# EAGLE design untitled (EAGLE 9.6.2)
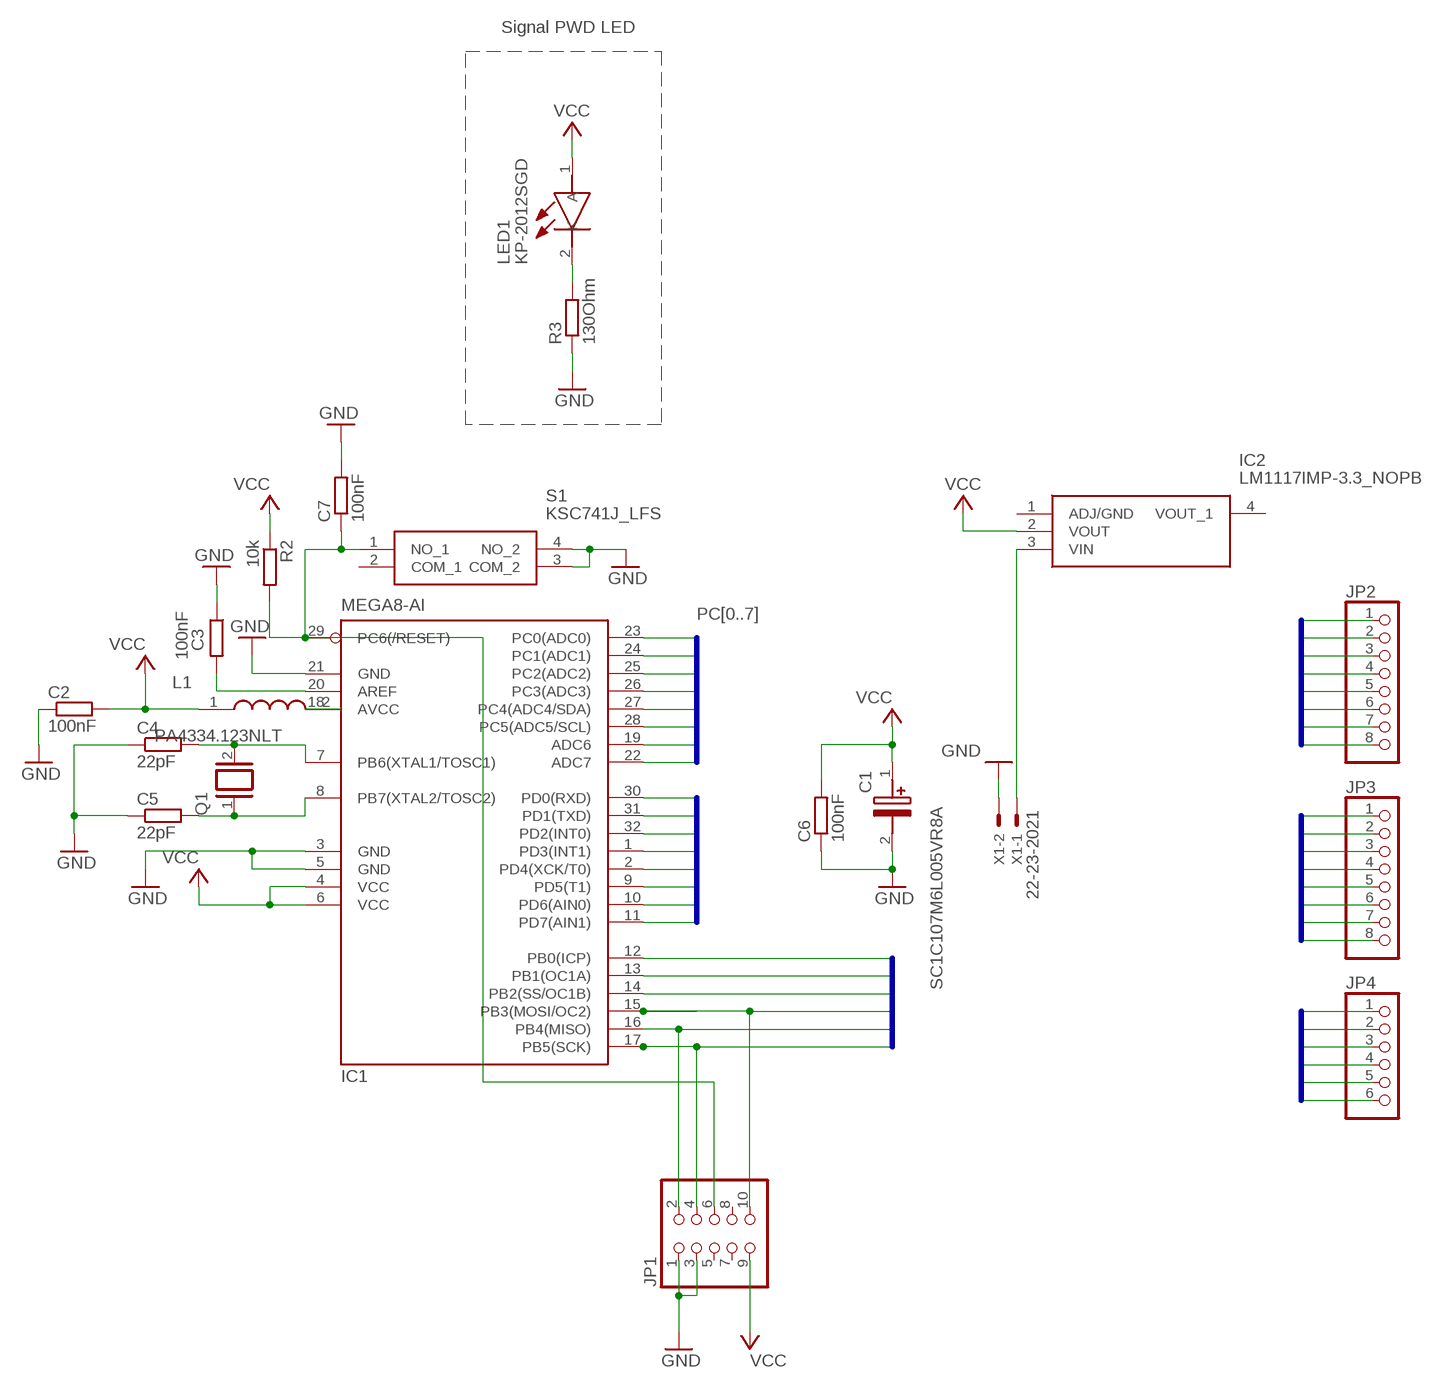
[diagram p0: schematic, sheet 1]

## Parts
C1  SC1C107M6L005VR8A  [CAPAE660X560N]
C2  100nF  R-EU_R0805  [R0805]
C3  100nF  R-EU_R0805  [R0805]
C4  22pF  R-EU_R0805  [R0805]
C5  22pF  R-EU_R0805  [R0805]
C6  100nF  R-EU_R0805  [R0805]
C7  100nF  R-EU_R0805  [R0805]
IC1  MEGA8-AI  [TQFP32-08]
IC2  LM1117IMP-3.3_NOPB  [SOT230P700X180-4N]
JP1  PINHD-2X5  [2X05]
JP2  PINHD-1X8  [1X08]
JP3  PINHD-1X8  [1X08]
JP4  PINHD-1X6  [1X06]
L1  PA4334.123NLT  [PA4334123NLT]
LED1  KP-2012SGD  [KP2012SGD]
Q1  XTAL/S  [QS]
R2  10k  R-EU_R0805  [R0805]
R3  130Ohm  R-EU_R0805  [R0805]
S1  KSC741J_LFS  [KSC821JOLLFS]
X1  22-23-2021  [22-23-2021]

## Nets
GND: C1.2(-) C2.1 C3.1 C4.1 C5.1 C6.1 C7.2 IC1.3(GND) IC1.5(GND) IC1.21(GND) JP1.1 JP1.3 R3.1 S1.3(COM_2) S1.4(NO_2) X1.2
N$1: C7.1 IC1.29(PC6(/RESET)) JP1.6 R2.2 S1.1(NO_1)
N$2: IC1.18(AVCC) L1.2
N$3: C3.2 IC1.20(AREF)
N$4: C4.2 IC1.7(PB6(XTAL1/TOSC1)) Q1.2
N$5: C5.2 IC1.8(PB7(XTAL2/TOSC2)) Q1.1
N$6: LED1.2(K) R3.2
N$7: IC2.3(VIN) X1.1
PB0: IC1.12(PB0(ICP)) JP4.1
PB1: IC1.13(PB1(OC1A)) JP4.2
PB2: IC1.14(PB2(SS/OC1B)) JP4.3
PB3: IC1.15(PB3(MOSI/OC2)) JP1.10 JP4.4
PB4: IC1.16(PB4(MISO)) JP1.2 JP4.5
PB5: IC1.17(PB5(SCK)) JP1.4 JP4.6
PC0: IC1.23(PC0(ADC0)) JP2.1
PC1: IC1.24(PC1(ADC1)) JP2.2
PC2: IC1.25(PC2(ADC2)) JP2.3
PC3: IC1.26(PC3(ADC3)) JP2.4
PC4: IC1.27(PC4(ADC4/SDA)) JP2.5
PC5: IC1.28(PC5(ADC5/SCL)) JP2.6
PC6: IC1.19(ADC6) JP2.7
PC7: IC1.22(ADC7) JP2.8
PD0: IC1.30(PD0(RXD)) JP3.1
PD1: IC1.31(PD1(TXD)) JP3.2
PD2: IC1.32(PD2(INT0)) JP3.3
PD3: IC1.1(PD3(INT1)) JP3.4
PD4: IC1.2(PD4(XCK/T0)) JP3.5
PD5: IC1.9(PD5(T1)) JP3.6
PD6: IC1.10(PD6(AIN0)) JP3.7
PD7: IC1.11(PD7(AIN1)) JP3.8
VCC: C1.1(+) C2.2 C6.2 IC1.4(VCC) IC1.6(VCC) IC2.2(VOUT) JP1.9 L1.1 LED1.1(A) R2.1
Unconnected: IC2.4(VOUT_1) JP1.5 JP1.7 JP1.8 S1.2(COM_1)

## Buses
PC[0..7]
PD[0..7]
PB[0..5]

## Notes on the sheet
- Signal PWD LED

## Power pins joined to a net without a drawn wire
ADJ/GND: IC2.1(ADJ/GND)

## Library data of the parts
C1 = SamacSys_Parts:SC1C107M6L005VR8A: SURFACE MOUNT ALUMINUM ELECTROLYTIC CAPACITOR Source: Datasheet <https://store.comet.bg/download-file.php?id=10409>; DESCRIPTION: SURFACE MOUNT ALUMINUM ELECTROLYTIC CAPACITOR; HEIGHT: 5.6mm; MANUFACTURER_NAME: Samwha Capacitor; MANUFACTURER_PART_NUMBER: SC1C107M6L005VR8A
C2-C7 R2 R3 = rcl:R-EU_: RESISTOR, European symbol; SPICEPREFIX: R
IC1 = atmel:MEGA8: MICROCONTROLLER 8 Kbytes FLASH, 1 kbytes SRAM, 512 bytes EEPROM, USART, 6-channel 10 bit ADC, 2-channel 8 bit ADC Pin compatible with Atmega48, ATMega88, ATMega168 Source: avr.lbr; MPN: ATMEGA8-16AU; OC_FARNELL: 9171371; OC_NEWARK: 73M8863
IC2 = SamacSys_Parts:LM1117IMP-3.3_NOPB: LM1117IMP-3.3/NOPB, Low Dropout Voltage Regulator, 1.5A, 3.3 V +/-1%, 4-Pin SOT-223 Source: Datasheet <http://docs-emea.rs-online.com/webdocs/05bb/0900766b805bb323.pdf>; DESCRIPTION: LM1117IMP-3.3/NOPB, Low Dropout Voltage Regulator, 1.5A, 3.3 V +/-1%, 4-Pin SOT-223; HEIGHT: 1.8mm; MANUFACTURER_NAME: Texas Instruments; MANUFACTURER_PART_NUMBER: LM1117IMP-3.3/NOPB; MOUSER_PART_NUMBER: 926-LM1117IMP3.3NOPB; MOUSER_PRICE-STOCK: https://www.mouser.com/Search/Refine.aspx?Keyword=926-LM1117IMP3.3NOPB; RS_PART_NUMBER: 1977198; RS_PRICE-STOCK: http://uk.rs-online.com/web/p/products/1977198
JP1 = pinhead:PINHD-2X5: PIN HEADER
JP2 JP3 = pinhead:PINHD-1X8: PIN HEADER
JP4 = pinhead:PINHD-1X6: PIN HEADER
L1 = SamacSys_Parts:PA4334.123NLT: Fixed Inductors IND, PWR, 3X3X1.2 12 uH, SMT Source: Datasheet <http://productfinder.pulseeng.com/products/datasheets/P763.pdf>; ARROW_PART_NUMBER: PA4334.123NLT; ARROW_PRICE-STOCK: https://www.arrow.com/en/products/pa4334.123nlt/pulse-electronics-corporation; DESCRIPTION: Fixed Inductors IND, PWR, 3X3X1.2 12 uH, SMT; HEIGHT: 1.2mm; MANUFACTURER_NAME: Pulse; MANUFACTURER_PART_NUMBER: PA4334.123NLT; MOUSER_PART_NUMBER: 673-PA4334123NLT; MOUSER_PRICE-STOCK: https://www.mouser.co.uk/ProductDetail/Pulse-Electronics/PA4334123NLT?qs=%2FzQKu7YvIMZI5byjWFMy2Q%3D%3D
LED1 = SamacSys_Parts:KP-2012SGD: LED; SMD; 0805; green; 312mcd; 2x1.25x1.1mm; 120; 2.22.5V; 20mA Source: Datasheet <https://www.arrow.com/en/products/kp-2012sgd/kingbright>; ARROW_PART_NUMBER: KP-2012SGD; ARROW_PRICE-STOCK: https://www.arrow.com/en/products/kp-2012sgd/kingbright; DESCRIPTION: LED; SMD; 0805; green; 312mcd; 2x1.25x1.1mm; 120; 2.22.5V; 20mA; HEIGHT: 1.2mm; MANUFACTURER_NAME: Kingbright; MANUFACTURER_PART_NUMBER: KP-2012SGD; MOUSER_PART_NUMBER: N/A; MOUSER_PRICE-STOCK: https://www.mouser.co.uk/ProductDetail/Kingbright/KP-2012SGD?qs=2JU0tDl2GZ3ofCdUidPmmg%3D%3D
Q1 = special:XTAL/S: CRYSTAL
S1 = SamacSys_Parts:KSC741J_LFS: IP67 Tactile Tactile Switch, SPST-NO 50 mA 1.4mm Surface Mount Source: Datasheet <https://componentsearchengine.com/Datasheets/1/KSC741J LFS.pdf>; ARROW_PART_NUMBER: KSC741J LFS; DESCRIPTION: IP67 Tactile Tactile Switch, SPST-NO 50 mA 1.4mm Surface Mount; HEIGHT: 4mm; MANUFACTURER_NAME: C & K COMPONENTS; MANUFACTURER_PART_NUMBER: KSC741J LFS; MOUSER_PART_NUMBER: 611-KSC741JLFS; MOUSER_PRICE-STOCK: https://www.mouser.com/Search/Refine.aspx?Keyword=611-KSC741JLFS
X1 = con-molex:22-23-2021: .100" (2.54mm) Center Header - 2 Pin; MF: MOLEX; MPN: 22-23-2021; OC_FARNELL: 1462926; OC_NEWARK: 25C3832

## Board
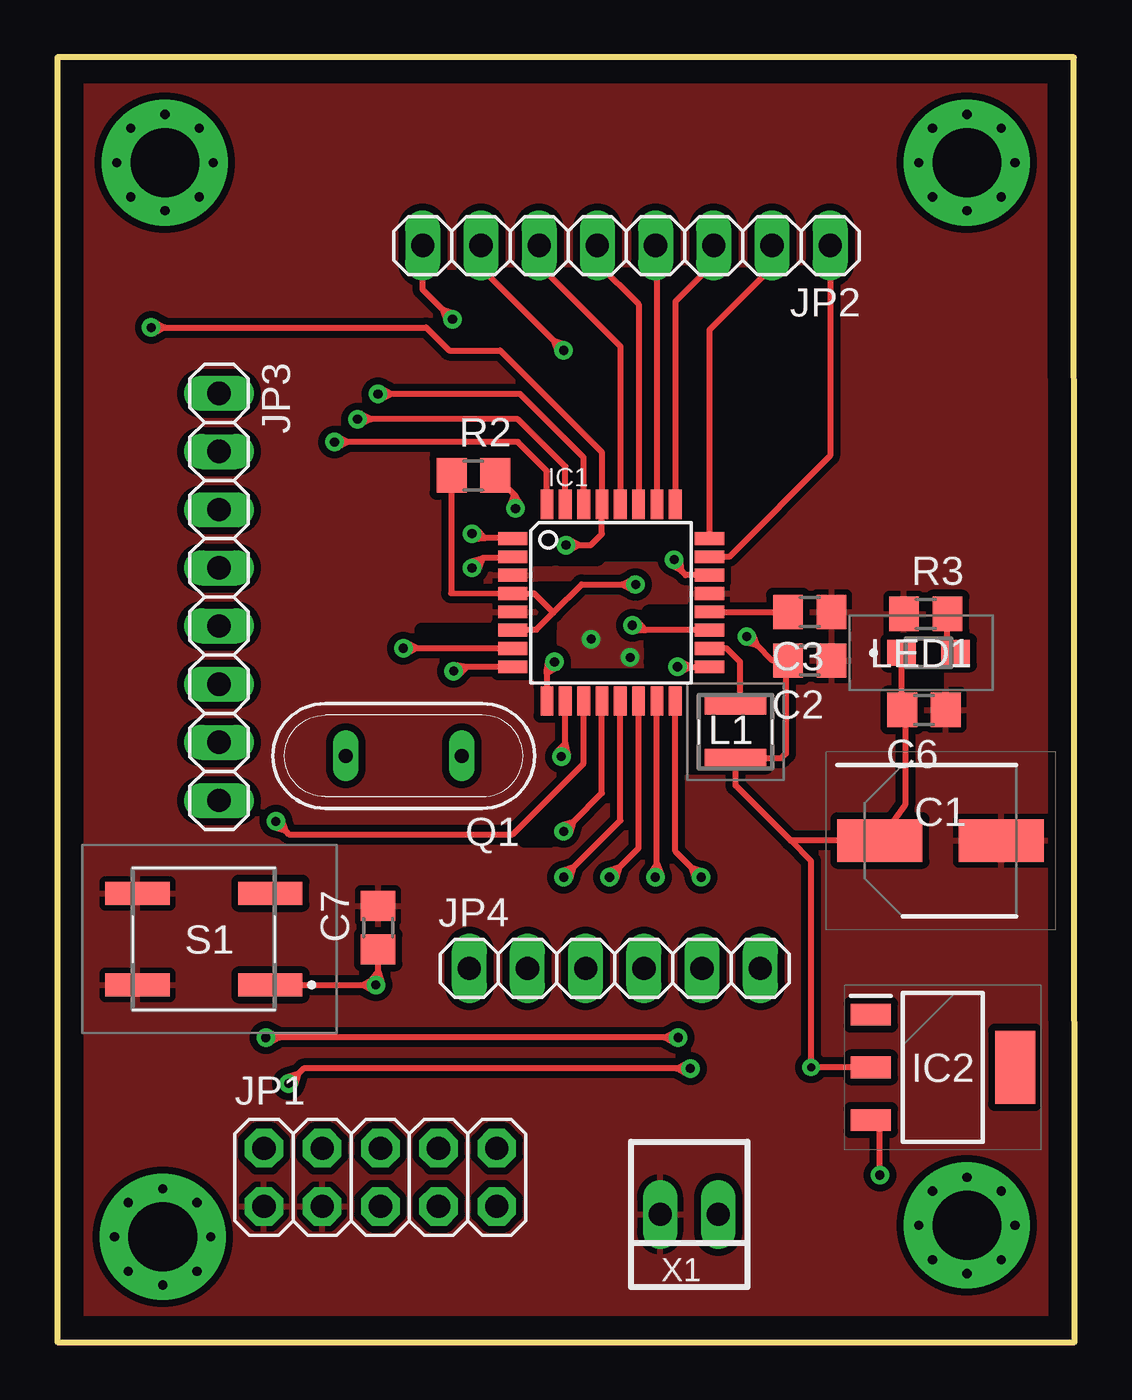
[diagram p1: board, top side]
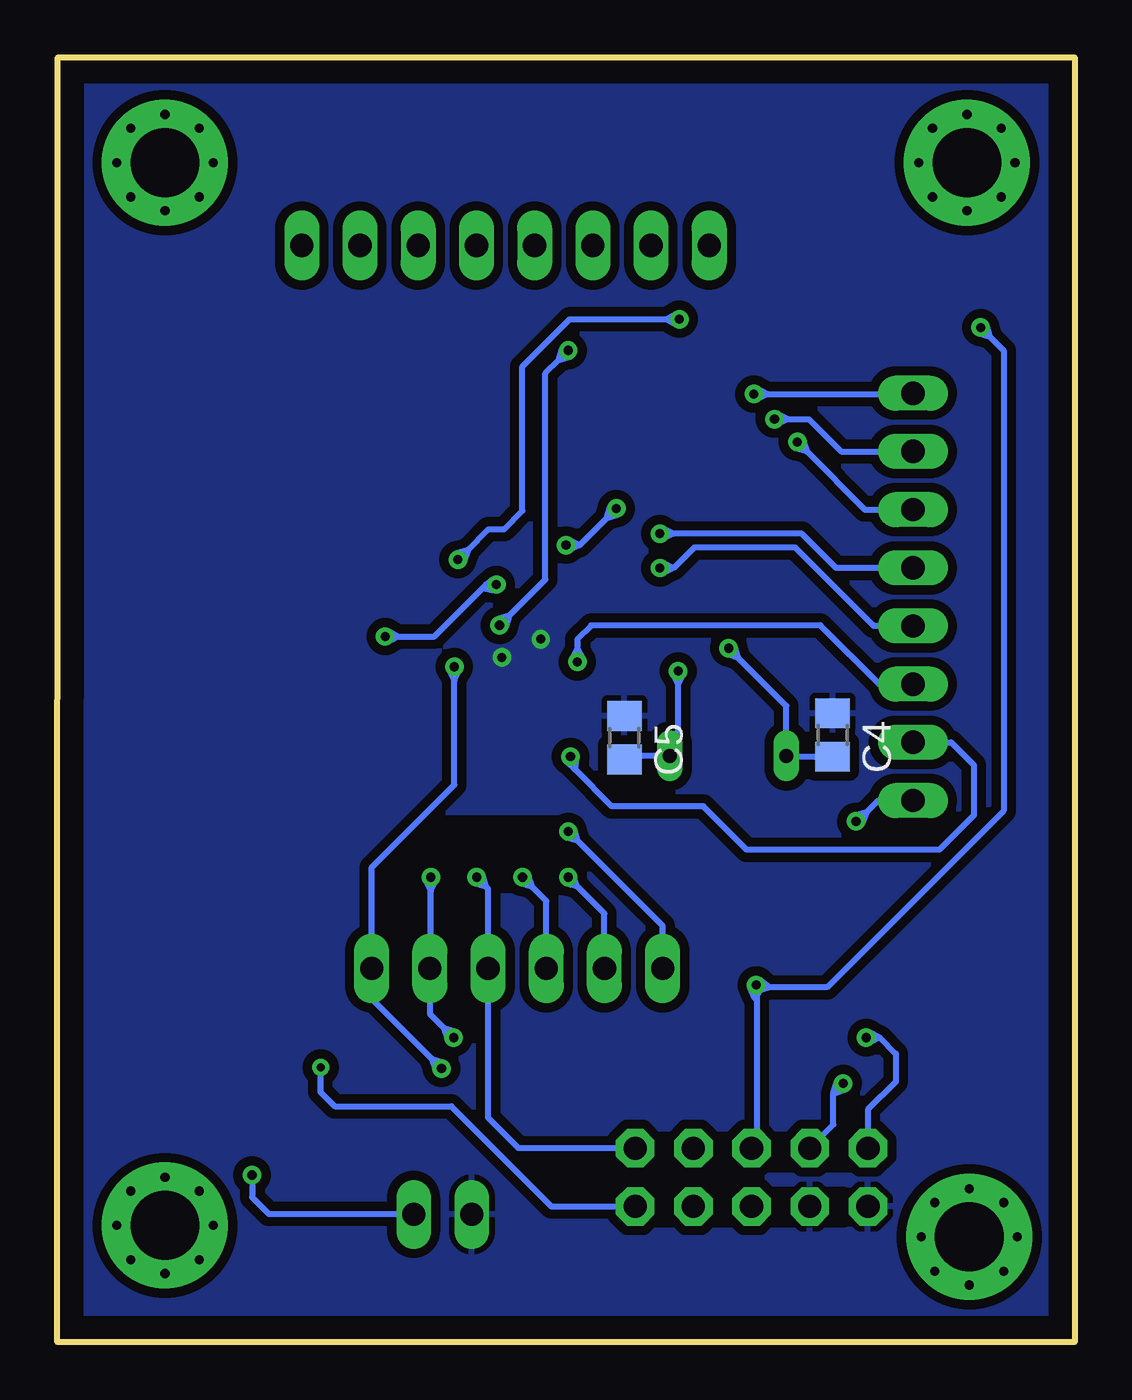
[diagram p2: board, bottom side, seen from below]

Size 44.4 x 56.1 mm. Coordinates in mm from the lower left corner, seen from the top.
Outline: 0,0 44.4,0 44.37,56.1 0,56.1 0,0
Copper layers (1*16): Top 0.035mm / dielectric 1.5mm / Bottom 0.035mm
Design rules "default *": minimum track width 6mil, minimum drill 0.35mm, track to track 9mil, track to pad 9mil, pad to pad 9mil, via to via 9mil, smd to smd 9mil, copper to edge 40mil, drill to drill 10mil, minimum pad ring 10mil, minimum via ring 8mil, stop-mask expansion 4mil, vias tented up to drill 0mil, thermal gap 10mil
tRestrict: area 29.6,46.3 to 30.2,46.6; area 16.9,46.2 to 17.5,46.5; area 19.5,46.3 to 20.1,46.6; area 22,46.3 to 22.6,46.6; area 24.6,46.3 to 25.2,46.6; area 27,46.4 to 27.6,46.7; area 32.2,46.4 to 32.8,46.7; area 28.2,26.1 to 31.5,27.3; area 37.6,28.6 to 38.4,29.4; area 20.7,34.2 to 21.6,34.8; area 24.1,34.6 to 27.6,35.7; area 25.8,31.4 to 27.6,31.9; 9 more areas
bRestrict: area 21.8,20 to 28.1,22.6; area 10.1,5.4 to 18.9,6.4; area 10,7.8 to 18.5,8.8

### Footprints (pad centres in the part's own frame; a part is rotated, then mirrored left to right if it is on the bottom)
CAPAE660X560N = smd 3.7 x 1.85: 1 -2.65,0; 2 2.65,0
R0805 = smd 1.3 x 1.5: 1 -0.95,0; 2 0.95,0
TQFP32-08 = smd 1.27 x 0.559: 1 -4.293,2.8; 2 -4.293,2; 3 -4.293,1.2; 4 -4.293,0.4; 5 -4.293,-0.4; 6 -4.293,-1.2; 7 -4.293,-2; 8 -4.293,-2.8; 17 4.293,-2.8; 18 4.293,-2; 19 4.293,-1.2; 20 4.293,-0.4; 21 4.293,0.4; 22 4.293,1.2; 23 4.293,2; 24 4.293,2.8 | smd 0.559 x 1.27: 9 -2.8,-4.293; 10 -2,-4.293; 11 -1.2,-4.293; 12 -0.4,-4.293; 13 0.4,-4.293; 14 1.2,-4.293; 15 2,-4.293; 16 2.8,-4.293; 25 2.8,4.293; 26 2,4.293; 27 1.2,4.293; 28 0.4,4.293; 29 -0.4,4.293; 30 -1.2,4.293; 31 -2,4.293; 32 -2.8,4.293
SOT230P700X180-4N = smd 1.75 x 0.95: 1 -3.15,2.3; 2 -3.15,0; 3 -3.15,-2.3 | smd 1.75 x 3.2: 4 3.15,0
2X05 = drill 1.016 pad 1.676 octagon: 1 -5.08,-1.27; 2 -5.08,1.27; 3 -2.54,-1.27; 4 -2.54,1.27; 5 0,-1.27; 6 0,1.27; 7 2.54,-1.27; 8 2.54,1.27; 9 5.08,-1.27; 10 5.08,1.27
1X08 = drill 1.016 long: 1 -8.89,0; 2 -6.35,0; 3 -3.81,0; 4 -1.27,0; 5 1.27,0; 6 3.81,0; 7 6.35,0; 8 8.89,0
1X06 = drill 1.016 long: 1 -6.35,0; 2 -3.81,0; 3 -1.27,0; 4 1.27,0; 5 3.81,0; 6 6.35,0
PA4334123NLT = smd 2.7 x 0.8: 1 0,1.15; 2 0,-1.15
KP2012SGD = smd 1.25 x 1.1: 1 -1.175,0; 2 1.175,0
QS = drill 0.61 long: 1 -2.54,0; 2 2.54,0
KSC821JOLLFS = smd 2.8 x 1: 1 -2.9,2; 2 -2.9,-2; 3 2.9,-2; 4 2.9,2
22-23-2021 = drill 1 long: 1 -1.27,0; 2 1.27,0

### Placement (x,y rotation side)
C1  38.55,21.9 0 top
C2  32.84,29.76 180 top
C3  32.84,31.88 180 top
C4  10.56,26.51 270 bottom
C5  19.65,26.39 270 bottom
C6  37.83,27.61 180 top
C7  14,18.1 90 top
IC1  24.17,32.29 0 top
IC2  38.65,12 0 top
JP1  14.1,7.2 0 top
JP2  24.84,47.88 180 top
JP3  7.06,32.54 270 top
JP4  24.33,16.32 0 top
L1  29.6,26.65 180 top
LED1  38.02,30.1 0 top
Q1  15.12,25.6 180 top
R2  18.16,37.84 0 top
R3  37.9,31.8 0 top
S1  6.4,17.6 180 top
X1  27.58,5.58 180 top

### Tracks (layer width: path | path; a pad name or v marks a point on that pad's centre or on a via)
GND  (via drill 0.4)
  other vias: 23.3,30.7 25,29.9
  pour Top (isolate 0.305): -0.19,56.42 44.76,56.42 44.76,0.04 -0.19,0.04
  pour Bottom (isolate 0.406): -0.3,0.4 -0.3,56.5 44.7,56.5 44.7,0.4
N$1  (via drill 0.4)
  Top 0.254: v4.1,44.3 4.62,44.3 | 4.62,44.3 4.7,44.3 | 4.7,44.3 16.1,44.3 17.1,43.3 19.33,43.3 23.77,38.86 IC1.29 23.77,35.29 23.28,34.8 22.8,34.8 | 4.62,44.3 4.2,44.5 v4.1,44.3 | 4.62,44.3 4.2,44.1 v4.1,44.3 | v22.2,34.8 22.8,34.8 | 13.3,15.6 v13.9,15.6 | v13.9,15.6 14,15.7 14,16.19 | R2.2 19.95,37 | 19.95,37 20,36.95 v20,36.4 | 14,16.19 C7.1 | 4.7,44.3 4.23,44.54 | v4.1,44.3 4.23,44.54 | 4.7,44.3 4.23,44.05 | v4.1,44.3 4.23,44.05 | 4.7,44.3 4.23,44.54 | 4.23,44.54 | v4.1,44.3 4.23,44.54 | 4.7,44.3 4.23,44.05 | v4.1,44.3 4.23,44.05 | 4.7,44.3 4.23,44.54 | v4.1,44.3 4.23,44.54 | 4.7,44.3 4.23,44.05 | v4.1,44.3 4.23,44.05 | 19.95,37 19.75,36.51 v20,36.4 | 19.95,37 20.23,36.55 v20,36.4 | 22.8,34.8 22.33,35.04 | v22.2,34.8 22.33,35.04 | 22.8,34.8 22.33,34.55 | v22.2,34.8 22.33,34.55 | 22.8,34.8 22.33,35.04 | 22.33,35.04 | v22.2,34.8 22.33,35.04 | 22.8,34.8 22.33,34.55 | v22.2,34.8 22.33,34.55 | 22.8,34.8 22.33,35.04 | v22.2,34.8 22.33,35.04 | 22.8,34.8 22.33,34.55 | v22.2,34.8 22.33,34.55 | 13.3,15.6 13.77,15.36 v13.9,15.6 | 13.3,15.6 13.77,15.85 v13.9,15.6 | 14,16.19 13.68,15.77 v13.9,15.6 | 14,16.19 14.16,15.68 v13.9,15.6 | S1.1 13.3,15.6
  Bottom 0.254: v13.9,15.6 13.93,15.57 13.93,15 | 13.87,15.1 13.87,8.73 JP1.6 | 3.68,43.88 3.1,43.3 3.1,23.2 10.8,15.5 13.31,15.5 | 3.68,43.88 3.73,43.93 | 3.73,43.93 v4.1,44.3 | 3.73,43.93 4.17,44.09 v4.1,44.3 | 3.73,43.93 3.89,44.38 v4.1,44.3 | v20,36.4 20.42,35.98 | 20.42,35.98 21.6,34.8 | 21.6,34.8 v22.2,34.8 | 13.31,15.5 13.8,15.5 v13.9,15.6 | 3.68,43.88 4.18,44.04 v4.1,44.3 | 3.68,43.88 3.84,44.38 v4.1,44.3 | 20.42,35.98 20.26,36.48 v20,36.4 | 20.42,35.98 19.92,36.14 v20,36.4 | 21.6,34.8 | 21.6,34.8 22.07,34.55 | v22.2,34.8 22.07,34.55 | 21.6,34.8 | 21.6,34.8 22.07,35.04 | v22.2,34.8 22.07,35.04 | 21.6,34.8 22.07,34.55 | 22.07,34.55 | v22.2,34.8 22.07,34.55 | 21.6,34.8 22.07,35.04 | v22.2,34.8 22.07,35.04 | 21.6,34.8 22.07,34.55 | v22.2,34.8 22.07,34.55 | 21.6,34.8 22.07,35.04 | v22.2,34.8 22.07,35.04 | 13.93,15 14.15,15.49 v13.9,15.6 | 13.93,15 13.87,15.1 | 13.87,15.1 13.66,15.46 v13.9,15.6 | 13.31,15.5 13.81,15.34 v13.9,15.6 | 13.31,15.5 13.73,15.82 v13.9,15.6
N$2
  Top 0.254: L1.2 29.8,28 29.8,29.7 29.21,30.29 IC1.18
N$3
  Top 0.254: IC1.20 C3.2
N$4  (via drill 0.4)
  Top 0.254: IC1.7 19.87,30.3 15.7,30.3 | v15.1,30.3 15.62,30.3 | 15.62,30.3 15.7,30.3 | 15.62,30.3 15.2,30.5 v15.1,30.3 | 15.62,30.3 15.2,30.1 v15.1,30.3 | 15.7,30.3 15.23,30.55 | v15.1,30.3 15.23,30.55 | 15.7,30.3 15.23,30.05 | v15.1,30.3 15.23,30.05 | 15.7,30.3 15.23,30.55 | 15.23,30.55 | v15.1,30.3 15.23,30.55 | 15.7,30.3 15.23,30.05 | v15.1,30.3 15.23,30.05 | 15.7,30.3 15.23,30.55 | v15.1,30.3 15.23,30.55 | 15.7,30.3 15.23,30.05 | v15.1,30.3 15.23,30.05
  Bottom 0.254: C4.2 12.54,25.56 Q1.2 12.58,27.78 14.68,29.88 | 14.68,29.88 14.73,29.93 | 14.73,29.93 v15.1,30.3 | 14.73,29.93 15.17,30.09 v15.1,30.3 | 14.73,29.93 14.89,30.38 v15.1,30.3 | 14.68,29.88 15.18,30.04 v15.1,30.3 | 14.68,29.88 14.84,30.38 v15.1,30.3
N$5  (via drill 0.4)
  Top 0.254: v17.3,29.3 17.49,29.49 17.79,29.49 | 17.79,29.49 17.32,29.53 v17.3,29.3 | 17.79,29.49 17.46,29.14 v17.3,29.3 | IC1.8 17.87,29.49 | 17.87,29.49 17.79,29.49 | 17.87,29.49 17.34,29.57 v17.3,29.3 | 17.87,29.49 17.5,29.11 v17.3,29.3
  Bottom 0.254: C5.2 19.49,25.6 Q1.1 17.3,25.96 17.3,28.7 | 17.3,28.7 17.3,28.78 | 17.3,28.78 v17.3,29.3 | 17.3,28.78 17.5,29.2 v17.3,29.3 | 17.3,28.78 17.1,29.2 v17.3,29.3 | 17.3,28.7 17.55,29.17 | v17.3,29.3 17.55,29.17 | 17.3,28.7 17.05,29.17 | v17.3,29.3 17.05,29.17 | 17.3,28.7 17.55,29.17 | 17.55,29.17 | v17.3,29.3 17.55,29.17 | 17.3,28.7 17.05,29.17 | v17.3,29.3 17.05,29.17 | 17.3,28.7 17.55,29.17 | v17.3,29.3 17.55,29.17 | 17.3,28.7 17.05,29.17 | v17.3,29.3 17.05,29.17
N$6
  Top 0.254: LED1.2 38.85,30.45 R3.2
N$7  (via drill 0.4)
  Top 0.254: IC2.3 35.9,9.3 v35.9,7.3
  Bottom 0.254: X1.1 28.87,5.6 35.17,5.6 35.9,6.33 v35.9,7.3
N$8  (via drill 3 pad 5.5)
  other vias: 39.7,51.5
N$9  (via drill 0.4 pad 0.01)
  other vias: 39.7,53.6
N$10  (via drill 0.4 pad 0.01)
  other vias: 39.7,49.4
N$11  (via drill 0.4 pad 0.01)
  other vias: 37.6,51.5
N$12  (via drill 0.4 pad 0.01)
  other vias: 41.8,51.5
N$13  (via drill 0.4 pad 0.01)
  other vias: 38.2,53
N$14  (via drill 0.4 pad 0.01)
  other vias: 38.2,50
N$15  (via drill 0.4 pad 0.01)
  other vias: 41.2,50
N$16  (via drill 0.4 pad 0.01)
  other vias: 41.2,53
N$17  (via drill 3 pad 5.5)
  other vias: 4.7,51.5
N$18  (via drill 0.4 pad 0.01)
  other vias: 4.7,53.6
N$19  (via drill 0.4 pad 0.01)
  other vias: 4.7,49.4
N$20  (via drill 0.4 pad 0.01)
  other vias: 2.6,51.5
N$21  (via drill 0.4 pad 0.01)
  other vias: 6.8,51.5
N$22  (via drill 0.4 pad 0.01)
  other vias: 3.2,53
N$23  (via drill 0.4 pad 0.01)
  other vias: 3.2,50
N$24  (via drill 0.4 pad 0.01)
  other vias: 6.2,50
N$25  (via drill 0.4 pad 0.01)
  other vias: 6.2,53
N$26  (via drill 3 pad 5.5)
  other vias: 4.6,4.6
N$27  (via drill 0.4 pad 0.01)
  other vias: 4.6,6.7
N$28  (via drill 0.4 pad 0.01)
  other vias: 4.6,2.5
N$29  (via drill 0.4 pad 0.01)
  other vias: 2.5,4.6
N$30  (via drill 0.4 pad 0.01)
  other vias: 6.7,4.6
N$31  (via drill 0.4 pad 0.01)
  other vias: 3.1,6.1
N$32  (via drill 0.4 pad 0.01)
  other vias: 3.1,3.1
N$33  (via drill 0.4 pad 0.01)
  other vias: 6.1,3.1
N$34  (via drill 0.4 pad 0.01)
  other vias: 6.1,6.1
N$35  (via drill 3 pad 5.5)
  other vias: 39.7,5.1
N$36  (via drill 0.4 pad 0.01)
  other vias: 39.7,7.2
N$37  (via drill 0.4 pad 0.01)
  other vias: 39.7,3
N$38  (via drill 0.4 pad 0.01)
  other vias: 37.6,5.1
N$39  (via drill 0.4 pad 0.01)
  other vias: 41.8,5.1
N$40  (via drill 0.4 pad 0.01)
  other vias: 38.2,6.6
N$41  (via drill 0.4 pad 0.01)
  other vias: 38.2,3.6
N$42  (via drill 0.4 pad 0.01)
  other vias: 41.2,3.6
N$43  (via drill 0.4 pad 0.01)
  other vias: 41.2,6.6
PB0  (via drill 0.4)
  Top 0.254: v22.1,22.3 22.47,22.67 | 22.47,22.67 22.52,22.72 | 22.52,22.72 23.77,23.97 IC1.12 | 22.47,22.67 22.03,22.51 v22.1,22.3 | 22.47,22.67 22.31,22.23 v22.1,22.3 | 22.52,22.72 22.02,22.56 v22.1,22.3 | 22.52,22.72 22.36,22.22 v22.1,22.3
  Bottom 0.254: JP4.1 17.98,18.18 21.68,21.88 | 21.68,21.88 21.73,21.93 | 21.73,21.93 v22.1,22.3 | 21.73,21.93 22.18,22.09 v22.1,22.3 | 21.73,21.93 21.89,22.38 v22.1,22.3 | 21.68,21.88 22.18,22.04 v22.1,22.3 | 21.68,21.88 21.84,22.38 v22.1,22.3
PB1  (via drill 0.4)
  Top 0.254: v22.1,20.3 22.47,20.67 | 22.47,20.67 22.52,20.72 | 22.52,20.72 24.57,22.77 IC1.13 | 22.47,20.67 22.03,20.51 v22.1,20.3 | 22.47,20.67 22.31,20.23 v22.1,20.3 | 22.52,20.72 22.02,20.56 v22.1,20.3 | 22.52,20.72 22.36,20.22 v22.1,20.3
  Bottom 0.254: JP4.2 20.52,18.72 21.68,19.88 | 21.68,19.88 21.73,19.93 | 21.73,19.93 v22.1,20.3 | 21.73,19.93 22.18,20.09 v22.1,20.3 | 21.73,19.93 21.89,20.38 v22.1,20.3 | 21.68,19.88 22,19.98 | 22,19.98 22.18,20.04 v22.1,20.3 | 22,19.98 v22.1,20.3
PB2  (via drill 0.4)
  Top 0.254: v24.1,20.3 24.47,20.67 | 24.47,20.67 24.52,20.72 | 24.52,20.72 25.37,21.57 IC1.14 | 24.47,20.67 24.03,20.51 v24.1,20.3 | 24.47,20.67 24.31,20.23 v24.1,20.3 | 24.52,20.72 24.02,20.56 v24.1,20.3 | 24.52,20.72 24.36,20.22 v24.1,20.3
  Bottom 0.254: JP4.3 23.06,19.26 23.68,19.88 | 23.68,19.88 23.73,19.93 | 23.73,19.93 v24.1,20.3 | 23.73,19.93 24.18,20.09 v24.1,20.3 | 23.73,19.93 23.89,20.38 v24.1,20.3 | 23.68,19.88 24.18,20.04 v24.1,20.3 | 23.68,19.88 23.84,20.38 v24.1,20.3
PB3  (via drill 0.4)
  Top 0.254: v26.1,20.3 26.17,20.37 26.17,20.82 | 26.17,20.82 26.17,20.9 | 26.17,20.9 IC1.15 | 26.17,20.82 25.91,20.42 v26.1,20.3 | 26.17,20.82 26.32,20.37 v26.1,20.3 | 26.17,20.9 25.87,20.46 v26.1,20.3 | 26.17,20.9 26.36,20.4 v26.1,20.3
  Bottom 0.254: 25.68,19.88 25.6,19.8 JP4.4 25.6,9.8 24.27,8.47 JP1.10 | 25.68,19.88 25.73,19.93 | 25.73,19.93 v26.1,20.3 | 25.73,19.93 26.18,20.09 v26.1,20.3 | 25.73,19.93 25.89,20.38 v26.1,20.3 | 25.68,19.88 26.18,20.04 v26.1,20.3 | 25.68,19.88 25.84,20.38 v26.1,20.3
PB4  (via drill 0.4)
  Top 0.254: v28.1,20.3 27.73,20.67 | 27.73,20.67 27.68,20.72 | 27.68,20.72 26.97,21.43 IC1.16 | v27.1,13.3 26.58,13.3 | 26.58,13.3 26.5,13.3 | 26.5,13.3 9.7,13.3 | 9.7,13.3 9.62,13.3 | 9.62,13.3 v9.1,13.3 | 27.73,20.67 27.89,20.23 v28.1,20.3 | 27.73,20.67 28.18,20.51 v28.1,20.3 | 26.58,13.3 27,13.1 v27.1,13.3 | 26.58,13.3 27,13.5 v27.1,13.3 | 9.62,13.3 9.2,13.5 v9.1,13.3 | 9.62,13.3 9.2,13.1 v9.1,13.3 | 27.68,20.72 27.84,20.22 v28.1,20.3 | 27.68,20.72 28.18,20.56 v28.1,20.3 | 26.5,13.3 | 26.5,13.3 26.97,13.06 | v27.1,13.3 26.97,13.06 | 26.5,13.3 | 26.5,13.3 26.97,13.54 | v27.1,13.3 26.97,13.54 | 26.5,13.3 26.97,13.06 | 26.97,13.06 | v27.1,13.3 26.97,13.06 | 26.5,13.3 26.97,13.54 | v27.1,13.3 26.97,13.54 | 26.5,13.3 26.97,13.06 | v27.1,13.3 26.97,13.06 | 26.5,13.3 26.97,13.54 | v27.1,13.3 26.97,13.54 | 9.7,13.3 9.23,13.54 | v9.1,13.3 9.23,13.54 | 9.7,13.3 9.23,13.06 | v9.1,13.3 9.23,13.06 | 9.7,13.3 9.23,13.54 | 9.23,13.54 | v9.1,13.3 9.23,13.54 | 9.7,13.3 9.23,13.06 | v9.1,13.3 9.23,13.06 | 9.7,13.3 9.23,13.54 | v9.1,13.3 9.23,13.54 | 9.7,13.3 9.23,13.06 | v9.1,13.3 9.23,13.06
  Bottom 0.254: 28.1,19.7 28.1,16.36 JP4.5 28.14,14.34 27.52,13.72 | 28.1,19.7 28.1,19.78 | 28.1,19.78 v28.1,20.3 | 27.52,13.72 27.47,13.67 | 27.47,13.67 v27.1,13.3 | v9.1,13.3 8.57,13.3 | 8.57,13.3 8.5,13.3 | 8.5,13.3 7.8,12.6 7.8,11.38 9.02,10.16 JP1.2 | 28.1,19.78 28.3,20.2 v28.1,20.3 | 28.1,19.78 27.9,20.2 v28.1,20.3 | 27.47,13.67 27.03,13.51 v27.1,13.3 | 27.47,13.67 27.31,13.23 v27.1,13.3 | 8.57,13.3 9,13.1 v9.1,13.3 | 8.57,13.3 9,13.5 v9.1,13.3 | 28.1,19.7 28.35,20.17 | v28.1,20.3 28.35,20.17 | 28.1,19.7 27.86,20.17 | v28.1,20.3 27.86,20.17 | 28.1,19.7 28.35,20.17 | 28.35,20.17 | v28.1,20.3 28.35,20.17 | 28.1,19.7 27.86,20.17 | v28.1,20.3 27.86,20.17 | 28.1,19.7 28.35,20.17 | v28.1,20.3 28.35,20.17 | 28.1,19.7 27.86,20.17 | v28.1,20.3 27.86,20.17 | 27.52,13.72 27.02,13.56 v27.1,13.3 | 27.52,13.72 27.36,13.22 v27.1,13.3 | 8.5,13.3 | 8.5,13.3 | 8.5,13.3 8.97,13.06 | v9.1,13.3 8.97,13.06 | 8.5,13.3 | 8.5,13.3 8.97,13.54 | v9.1,13.3 8.97,13.54 | 8.5,13.3 8.97,13.06 | 8.97,13.06 | v9.1,13.3 8.97,13.06 | 8.5,13.3 8.97,13.54 | v9.1,13.3 8.97,13.54 | 8.5,13.3 8.97,13.06 | v9.1,13.3 8.97,13.06 | 8.5,13.3 8.97,13.54 | v9.1,13.3 8.97,13.54
PB5  (via drill 0.4)
  Top 0.254: v27.07,29.49 27.6,29.49 | 27.6,29.49 27.67,29.49 | 27.67,29.49 IC1.17 | v27.63,11.95 27.11,11.95 | 27.11,11.95 27.03,11.95 | 27.03,11.95 10.75,11.95 10.52,11.72 | 10.52,11.72 10.47,11.67 | 10.47,11.67 v10.1,11.3 | 27.6,29.49 27.17,29.69 v27.07,29.49 | 27.6,29.49 27.17,29.29 v27.07,29.49 | 27.11,11.95 27.53,11.75 v27.63,11.95 | 27.11,11.95 27.53,12.15 v27.63,11.95 | 10.47,11.67 10.03,11.51 v10.1,11.3 | 10.47,11.67 10.31,11.23 v10.1,11.3 | 27.67,29.49 27.2,29.73 | v27.07,29.49 27.2,29.73 | 27.67,29.49 27.2,29.25 | v27.07,29.49 27.2,29.25 | 27.67,29.49 27.2,29.73 | 27.2,29.73 | v27.07,29.49 27.2,29.73 | 27.67,29.49 27.2,29.25 | v27.07,29.49 27.2,29.25 | 27.67,29.49 27.2,29.73 | v27.07,29.49 27.2,29.73 | 27.67,29.49 27.2,29.25 | v27.07,29.49 27.2,29.25 | 27.03,11.95 | 27.03,11.95 27.5,11.71 | v27.63,11.95 27.5,11.71 | 27.03,11.95 | 27.03,11.95 27.5,12.2 | v27.63,11.95 27.5,12.2 | 27.03,11.95 27.5,11.71 | 27.5,11.71 | v27.63,11.95 27.5,11.71 | 27.03,11.95 27.5,12.2 | v27.63,11.95 27.5,12.2 | 27.03,11.95 27.5,11.71 | v27.63,11.95 27.5,11.71 | 27.03,11.95 27.5,12.2 | v27.63,11.95 27.5,12.2 | 10.52,11.72 10.02,11.56 v10.1,11.3 | 10.52,11.72 10.36,11.22 v10.1,11.3
  Bottom 0.254: 27.07,28.89 27.07,24.33 30.68,20.72 JP4.6 30.68,15 28.05,12.37 | 27.07,28.89 27.07,28.96 | 27.07,28.96 v27.07,29.49 | 28.05,12.37 28,12.32 | 28,12.32 v27.63,11.95 | v10.1,11.3 10.52,10.88 | 27.07,28.96 27.27,29.39 v27.07,29.49 | 27.07,28.96 26.87,29.39 v27.07,29.49 | 28,12.32 27.55,12.16 v27.63,11.95 | 28,12.32 27.84,11.88 v27.63,11.95 | v10.1,11.3 10.11,11.26 10.03,11.23 10.06,11.31 v10.1,11.3 | v10.1,11.3 10.13,11.21 | 27.07,28.89 27.32,29.36 | v27.07,29.49 27.32,29.36 | 27.07,28.89 26.83,29.36 | v27.07,29.49 26.83,29.36 | 27.07,28.89 27.32,29.36 | 27.32,29.36 | v27.07,29.49 27.32,29.36 | 27.07,28.89 26.83,29.36 | v27.07,29.49 26.83,29.36 | 27.07,28.89 27.32,29.36 | v27.07,29.49 27.32,29.36 | 27.07,28.89 26.83,29.36 | v27.07,29.49 26.83,29.36 | 28.05,12.37 27.55,12.21 v27.63,11.95 | 28.05,12.37 27.89,11.87 v27.63,11.95 | 10.52,10.88 10.36,11.38 v10.1,11.3 | 10.45,10.9 10.02,11.04 v10.1,11.3 | JP1.4 10.52,9.51 10.52,10.88
PC0
  Top 0.254: JP2.1 33.73,38.7 29.32,34.29 IC1.23
PC1
  Top 0.254: JP2.2 31.19,46.92 28.46,44.19 IC1.24
PC2
  Top 0.254: JP2.3 28.65,47.12 26.97,45.44 IC1.25
PC3
  Top 0.254: JP2.4 26.17,47.82 IC1.26
PC4
  Top 0.254: JP2.5 23.57,47.12 25.37,45.32 IC1.27
PC5
  Top 0.254: JP2.6 21.03,47.02 24.57,43.48 IC1.28
PC6  (via drill 0.4)
  Top 0.254: IC1.19 25.66,31.09 | 25.66,31.09 25.58,31.09 | 25.58,31.09 25.31,31.09 v25.1,31.3 | v22.1,43.3 21.73,43.67 | 21.73,43.67 21.68,43.72 | 21.68,43.72 18.49,46.91 JP2.7 | 25.58,31.09 25.27,31.45 v25.1,31.3 | 25.58,31.09 25.11,31.07 v25.1,31.3 | 21.73,43.67 21.89,43.22 v22.1,43.3 | 21.73,43.67 22.18,43.51 v22.1,43.3 | 25.66,31.09 25.3,31.48 v25.1,31.3 | 25.66,31.09 25.13,31.03 v25.1,31.3 | 21.68,43.72 21.84,43.22 v22.1,43.3 | 21.68,43.72 22.18,43.56 v22.1,43.3
  Bottom 0.254: v25.1,31.3 24.73,31.67 | 24.73,31.67 24.68,31.72 | 24.68,31.72 23.1,33.3 23.1,42.3 22.52,42.88 | 22.52,42.88 22.47,42.93 | 22.47,42.93 v22.1,43.3 | 24.73,31.67 24.89,31.23 v25.1,31.3 | 24.73,31.67 25.18,31.51 v25.1,31.3 | 22.47,42.93 22.31,43.38 v22.1,43.3 | 22.47,42.93 22.03,43.09 v22.1,43.3 | 24.68,31.72 24.84,31.22 v25.1,31.3 | 24.68,31.72 25.18,31.56 v25.1,31.3 | 22.52,42.88 22.36,43.38 v22.1,43.3 | 22.52,42.88 22.02,43.04 v22.1,43.3
PC7  (via drill 0.4)
  Top 0.254: IC1.22 27.42,33.49 27.25,33.66 | v26.92,34.17 26.92,33.99 27.19,33.72 | 27.25,33.66 27.19,33.72 | v17.25,44.66 16.88,45.03 | 16.88,45.03 16.83,45.08 | 16.83,45.08 15.95,45.96 JP2.8 | 27.19,33.72 27.15,34.19 v26.92,34.17 | 27.19,33.72 26.8,33.98 v26.92,34.17 | 16.88,45.03 17.04,44.58 v17.25,44.66 | 16.88,45.03 17.33,44.87 v17.25,44.66 | 27.25,33.66 27.2,34.2 v26.92,34.17 | 27.25,33.66 26.78,33.93 v26.92,34.17 | 16.83,45.08 16.99,44.58 v17.25,44.66 | 16.83,45.08 17.33,44.92 v17.25,44.66
  Bottom 0.254: v26.92,34.17 26.55,34.54 | 26.55,34.54 26.5,34.59 | 26.5,34.59 25.59,35.5 24.9,35.5 24.1,36.3 24.1,42.6 22.04,44.66 17.85,44.66 | 17.85,44.66 17.78,44.66 | 17.78,44.66 v17.25,44.66 | 26.55,34.54 26.71,34.09 v26.92,34.17 | 26.55,34.54 27,34.38 v26.92,34.17 | 17.78,44.66 17.35,44.86 v17.25,44.66 | 17.78,44.66 17.35,44.46 v17.25,44.66 | 26.5,34.59 26.66,34.09 v26.92,34.17 | 26.5,34.59 27,34.43 v26.92,34.17 | 17.85,44.66 17.38,44.9 | v17.25,44.66 17.38,44.9 | 17.85,44.66 17.38,44.41 | v17.25,44.66 17.38,44.41 | 17.85,44.66 17.38,44.9 | 17.38,44.9 | v17.25,44.66 17.38,44.9 | 17.85,44.66 17.38,44.41 | v17.25,44.66 17.38,44.41 | 17.85,44.66 17.38,44.9 | v17.25,44.66 17.38,44.9 | 17.85,44.66 17.38,44.41 | v17.25,44.66 17.38,44.41
PD0  (via drill 0.4)
  Top 0.254: IC1.30 22.97,38.63 20.2,41.4 14.6,41.4 | 14.6,41.4 14.53,41.4 | 14.53,41.4 v14,41.4 | 14.53,41.4 14.1,41.6 v14,41.4 | 14.53,41.4 14.1,41.2 v14,41.4 | 14.6,41.4 14.13,41.64 | v14,41.4 14.13,41.64 | 14.6,41.4 14.13,41.15 | v14,41.4 14.13,41.15 | 14.6,41.4 14.13,41.64 | 14.13,41.64 | v14,41.4 14.13,41.64 | 14.6,41.4 14.13,41.15 | v14,41.4 14.13,41.15 | 14.6,41.4 14.13,41.64 | v14,41.4 14.13,41.64 | 14.6,41.4 14.13,41.15 | v14,41.4 14.13,41.15
  Bottom 0.254: v14,41.4 13.47,41.4 | 13.47,41.4 13.4,41.4 | 13.4,41.4 7.09,41.4 JP3.1 | 13.47,41.4 13.9,41.2 v14,41.4 | 13.47,41.4 13.9,41.6 v14,41.4 | 13.4,41.4 | 13.4,41.4 13.87,41.15 | v14,41.4 13.87,41.15 | 13.4,41.4 | 13.4,41.4 13.87,41.64 | v14,41.4 13.87,41.64 | 13.4,41.4 13.87,41.15 | 13.87,41.15 | v14,41.4 13.87,41.15 | 13.4,41.4 13.87,41.64 | v14,41.4 13.87,41.64 | 13.4,41.4 13.87,41.15 | v14,41.4 13.87,41.15 | 13.4,41.4 13.87,41.64 | v14,41.4 13.87,41.64
PD1  (via drill 0.4)
  Top 0.254: IC1.31 22.17,38.23 20.1,40.3 13.7,40.3 | 13.7,40.3 13.62,40.3 | 13.62,40.3 v13.1,40.3 | 13.62,40.3 13.2,40.5 v13.1,40.3 | 13.62,40.3 13.2,40.1 v13.1,40.3 | 13.7,40.3 13.23,40.54 | v13.1,40.3 13.23,40.54 | 13.7,40.3 13.23,40.05 | v13.1,40.3 13.23,40.05 | 13.7,40.3 13.23,40.54 | 13.23,40.54 | v13.1,40.3 13.23,40.54 | 13.7,40.3 13.23,40.05 | v13.1,40.3 13.23,40.05 | 13.7,40.3 13.23,40.54 | v13.1,40.3 13.23,40.54 | 13.7,40.3 13.23,40.05 | v13.1,40.3 13.23,40.05
  Bottom 0.254: v13.1,40.3 12.57,40.3 | 12.57,40.3 12.5,40.3 | 12.5,40.3 11.6,40.3 10.19,38.89 JP3.2 | 12.57,40.3 13,40.1 v13.1,40.3 | 12.57,40.3 13,40.5 v13.1,40.3 | 12.5,40.3 | 12.5,40.3 12.97,40.05 | v13.1,40.3 12.97,40.05 | 12.5,40.3 | 12.5,40.3 12.97,40.54 | v13.1,40.3 12.97,40.54 | 12.5,40.3 12.97,40.05 | 12.97,40.05 | v13.1,40.3 12.97,40.05 | 12.5,40.3 12.97,40.54 | v13.1,40.3 12.97,40.54 | 12.5,40.3 12.97,40.05 | v13.1,40.3 12.97,40.05 | 12.5,40.3 12.97,40.54 | v13.1,40.3 12.97,40.54
PD2  (via drill 0.4)
  Top 0.254: IC1.32 21.37,38.03 20.1,39.3 12.7,39.3 | 12.7,39.3 12.62,39.3 | 12.62,39.3 v12.1,39.3 | 12.62,39.3 12.2,39.5 v12.1,39.3 | 12.62,39.3 12.2,39.1 v12.1,39.3 | 12.7,39.3 12.23,39.54 | v12.1,39.3 12.23,39.54 | 12.7,39.3 12.23,39.05 | v12.1,39.3 12.23,39.05 | 12.7,39.3 12.23,39.54 | 12.23,39.54 | v12.1,39.3 12.23,39.54 | 12.7,39.3 12.23,39.05 | v12.1,39.3 12.23,39.05 | 12.7,39.3 12.23,39.54 | v12.1,39.3 12.23,39.54 | 12.7,39.3 12.23,39.05 | v12.1,39.3 12.23,39.05
  Bottom 0.254: v12.1,39.3 11.73,38.93 | 11.73,38.93 11.68,38.88 | 11.68,38.88 9.15,36.35 JP3.3 | 11.73,38.93 12.17,39.09 v12.1,39.3 | 11.73,38.93 11.89,39.38 v12.1,39.3 | 11.68,38.88 12.18,39.04 v12.1,39.3 | 11.68,38.88 11.84,39.38 v12.1,39.3
PD3  (via drill 0.4)
  Top 0.254: v18.1,35.3 18.3,35.1 18.59,35.1 | 18.67,35.1 19.87,35.1 IC1.1 | 18.67,35.1 18.59,35.1 | 18.59,35.1 18.27,35.45 v18.1,35.3 | 18.59,35.1 18.11,35.07 v18.1,35.3 | 18.67,35.1 18.3,35.49 v18.1,35.3 | 18.67,35.1 18.14,35.03 v18.1,35.3
  Bottom 0.254: JP3.4 10.41,33.81 11.9,35.3 17.5,35.3 | 17.5,35.3 17.58,35.3 | 17.58,35.3 v18.1,35.3 | 17.58,35.3 18,35.1 v18.1,35.3 | 17.58,35.3 18,35.5 v18.1,35.3 | 17.5,35.3 | 17.5,35.3 17.97,35.05 | v18.1,35.3 17.97,35.05 | 17.5,35.3 | 17.5,35.3 17.97,35.54 | v18.1,35.3 17.97,35.54 | 17.5,35.3 17.97,35.05 | 17.97,35.05 | v18.1,35.3 17.97,35.05 | 17.5,35.3 17.97,35.54 | v18.1,35.3 17.97,35.54 | 17.5,35.3 17.97,35.05 | v18.1,35.3 17.97,35.05 | 17.5,35.3 17.97,35.54 | v18.1,35.3 17.97,35.54
PD4  (via drill 0.4)
  Top 0.254: IC1.2 19.84,34.25 18.59,34.25 18.54,34.21 | v18.1,33.8 18.13,33.8 18.49,34.15 | 18.49,34.15 18.54,34.21 | 18.54,34.21 | 18.49,34.15 18.03,34.02 v18.1,33.8 | 18.49,34.15 18.3,33.68 18.17,33.73 v18.1,33.8 | 18.54,34.21 18.03,34.07 | 18.03,34.07 | 18.54,34.21 18.36,33.71 | 18.54,34.21 18.03,34.07 | v18.1,33.8 18.03,34.07 | 18.54,34.21 18.36,33.71 | v18.1,33.8 18.36,33.71
  Bottom 0.254: JP3.5 8.77,31.27 12.2,34.7 16.6,34.7 17.5,33.8 | 17.5,33.8 17.58,33.8 | 17.58,33.8 v18.1,33.8 | 17.58,33.8 18,33.6 v18.1,33.8 | 17.58,33.8 17.96,33.98 18.01,33.89 v18.1,33.8 | 17.5,33.8 | 17.5,33.8 17.97,33.55 | v18.1,33.8 17.97,33.55 | 17.5,33.8 | 17.5,33.8 17.97,34.04 | v18.1,33.8 17.97,34.04 | 17.5,33.8 17.97,33.55 | 17.97,33.55 | v18.1,33.8 17.97,33.55 | 17.5,33.8 17.97,34.04 | v18.1,33.8 17.97,34.04 | 17.5,33.8 17.97,33.55 | v18.1,33.8 17.97,33.55 | 17.5,33.8 17.97,34.04 | v18.1,33.8 17.97,34.04
PD5  (via drill 0.4)
  Top 0.254: 21.36,29.21 IC1.9 | v21.7,29.7 21.36,29.36 21.36,29.21 | 21.36,29.21 21.83,29.46 v21.7,29.7 | 21.36,29.21 21.43,29.73 v21.7,29.7
  Bottom 0.254: JP3.6 8.53,28.73 11.1,31.3 21.1,31.3 21.7,30.7 21.7,30.3 | 21.7,30.3 v21.7,29.7 | 21.7,30.3 | 21.7,30.3 21.46,29.83 | v21.7,29.7 21.46,29.83 | 21.7,30.3 | 21.7,30.3 21.95,29.83 | v21.7,29.7 21.95,29.83 | 21.7,30.3 21.46,29.83 | 21.46,29.83 | v21.7,29.7 21.46,29.83 | 21.7,30.3 21.95,29.83 | v21.7,29.7 21.95,29.83 | 21.7,30.3 21.46,29.83 | v21.7,29.7 21.46,29.83 | 21.7,30.3 21.95,29.83 | v21.7,29.7 21.95,29.83
PD6  (via drill 0.4)
  Top 0.254: v22,25.57 22.17,25.74 22.17,26.07 | 22.17,26.07 22.17,26.14 | 22.17,26.14 IC1.10 | 22.17,26.07 21.84,25.73 v22,25.57 | 22.17,26.07 22.22,25.6 v22,25.57 | 22.17,26.14 21.8,25.76 v22,25.57 | 22.17,26.14 22.27,25.62 v22,25.57
  Bottom 0.254: JP3.7 5.39,26.19 4.4,25.2 4.4,23 5.9,21.5 14.3,21.5 16.2,23.4 20.2,23.4 21.8,25 | 21.8,25 21.86,25.06 | 21.86,25.06 22,25.2 v22,25.57 | 21.86,25.06 22.17,25.42 v22,25.57 | 21.86,25.06 21.78,25.53 v22,25.57 | 21.8,25 22.19,25.37 v22,25.57 | 21.8,25 21.73,25.53 v22,25.57
PD7  (via drill 0.4)
  Top 0.254: v9.54,22.74 9.91,22.37 | 9.91,22.37 9.96,22.32 | 9.96,22.32 10.11,22.17 19.87,22.17 22.97,25.27 IC1.11 | 9.91,22.37 9.75,22.82 v9.54,22.74 | 9.91,22.37 9.46,22.53 v9.54,22.74 | 9.96,22.32 9.8,22.82 v9.54,22.74 | 9.96,22.32 9.46,22.48 v9.54,22.74
  Bottom 0.254: JP3.8 8.57,23.65 9.09,23.13 | 9.09,23.13 9.14,23.08 | 9.14,23.08 9.5,22.72 9.52,22.72 v9.54,22.74 | 9.14,23.08 9.33,22.65 v9.54,22.74 | 9.14,23.08 9.6,22.96 v9.54,22.74 | 9.09,23.13 9.28,22.64 v9.54,22.74 | 9.09,23.13 9.61,23.01 v9.54,22.74
VCC  (via drill 0.35, 0.4)
  Top 0.254: 30.54,30.41 31.19,29.76 C2.2 31.8,29.67 31.8,25.7 31.6,25.5 L1.1 29.6,24.3 32,21.9 | 30.54,30.41 30.49,30.46 | 30.49,30.46 30.14,30.81 v30.09,30.81 | 21.65,31.85 22.88,33.08 24.64,33.08 | 24.64,33.08 24.71,33.08 | 24.71,33.08 v25.24,33.08 | 30.49,30.46 30.24,30.9 v30.09,30.81 | 30.49,30.46 30.03,30.65 v30.09,30.81 | 24.71,33.08 25.18,32.91 v25.24,33.08 | 24.71,33.08 25.18,33.24 v25.24,33.08 | R2.1 17.19,32.7 IC1.4 20.81,32.69 21.65,31.85 | IC1.6 19.89,31.11 20.91,31.11 21.65,31.85 | 30.54,30.41 30.35,30.91 v30.09,30.81 | 30.54,30.41 30.02,30.54 v30.09,30.81 | 24.64,33.08 | 24.64,33.08 25.11,32.83 | v25.24,33.08 25.11,32.83 | 24.64,33.08 | 24.64,33.08 25.11,33.32 | v25.24,33.08 25.11,33.32 | 24.64,33.08 25.11,32.83 | 25.11,32.83 | v25.24,33.08 25.11,32.83 | 24.64,33.08 25.11,33.32 | v25.24,33.08 25.11,33.32 | 24.64,33.08 25.11,32.83 | v25.24,33.08 25.11,32.83 | 24.64,33.08 25.11,33.32 | v25.24,33.08 25.11,33.32 | 32,21.9 32.9,21 v32.9,12 IC2.2 | 32,21.9 C1.1 37,23.46 37,27.49 C6.2 36.85,27.64 LED1.1
  Bottom 0.254: v30.09,30.81 29.57,30.81 | 29.57,30.81 29.49,30.81 | 29.49,30.81 27.95,30.81 25.82,32.94 | v25.24,33.08 25.68,33.08 25.76,33 | 25.82,32.94 25.76,33 | 29.57,30.81 30.03,30.64 v30.09,30.81 | 29.57,30.81 30.03,30.98 v30.09,30.81 | 25.76,33 25.27,32.91 v25.24,33.08 | JP1.9 22.84,5.93 27.21,10.3 32.3,10.3 32.92,10.92 32.92,11.98 v32.9,12 | 29.49,30.81 | 29.49,30.81 29.96,30.57 | v30.09,30.81 29.96,30.57 | 29.49,30.81 | 29.49,30.81 29.96,31.05 | v30.09,30.81 29.96,31.05 | 29.49,30.81 29.96,30.57 | 29.96,30.57 | v30.09,30.81 29.96,30.57 | 29.49,30.81 29.96,31.05 | v30.09,30.81 29.96,31.05 | 29.49,30.81 29.96,30.57 | v30.09,30.81 29.96,30.57 | 29.49,30.81 29.96,31.05 | v30.09,30.81 29.96,31.05 | 25.82,32.94 25.42,33.29 v25.24,33.08 | 25.82,32.94 25.3,32.81 v25.24,33.08